# Altium project ArcadeRpiSmartShield 33.PrjPCB
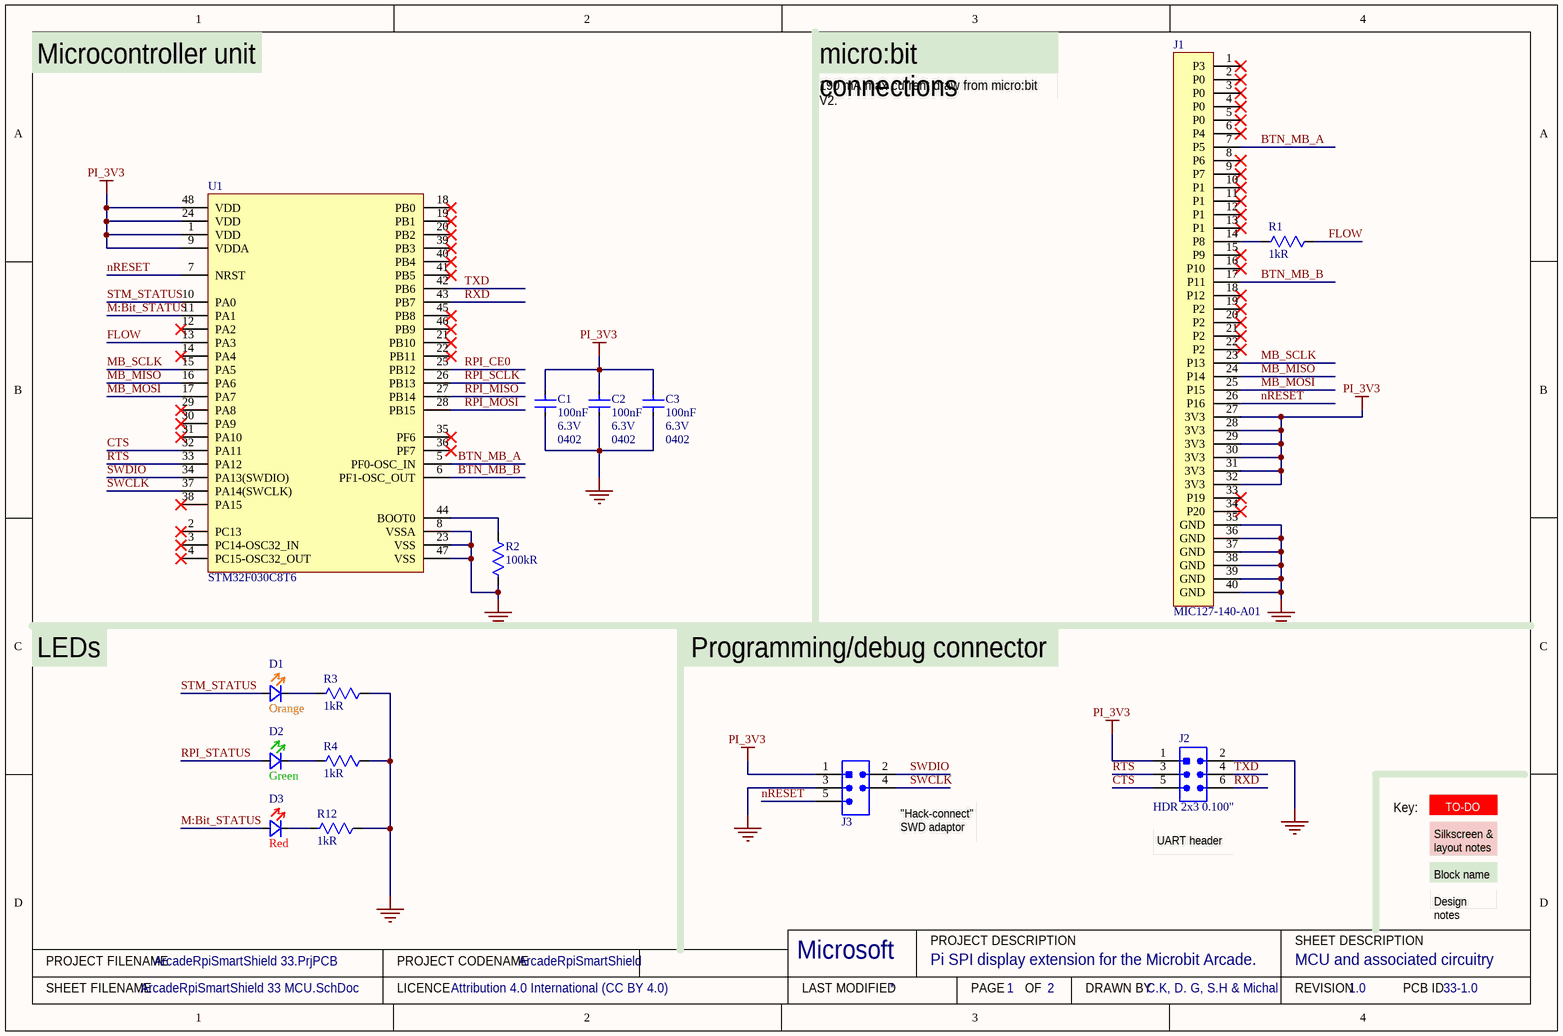
[diagram p0: ArcadeRpiSmartShield 33 MCU.SchDoc]
ProjectCodeName: ArcadeRpiSmartShield; ProjectCodenameDescription: Pi SPI display extension for the Microbit Arcade.; ProjectCodenameID: 33; ProjectDrawnBy: C.K, D. G, S.H & Michal; ProjectLicenceTerms: Attribution 4.0 International (CC BY 4.0); ProjectRevision: 1.0
2 sheets, 24 parts. Net scope: global (net labels, ports and power ports of the same name join across sheets).
Board file: ArcadeRpiSmartShield 33.PcbDoc
Sheets:
  ArcadeRpiSmartShield 33 MCU.SchDoc
  ArcadeRpiSmartShield 33 Pi interface.SchDoc

## Sheet ArcadeRpiSmartShield 33 MCU.SchDoc: MCU and associated circuitry
size A4; DrawnBy: C.K, D. G, S.H & Michal; DocumentNumber: 1; Revision: 1.0; SheetNumber: 1; SheetTotal: 2; VersionControl_RevNumber: 1

### Parts
C1  Capacitance: 100nF  Voltage Rating: 6.3V  Case Code (Imperial): 0402  [C0402_0.55MM - without outline]  (hidden comment: CL05B104KQ5NNNC)
C2  Capacitance: 100nF  Voltage Rating: 6.3V  Case Code (Imperial): 0402  [C0402_0.55MM - without outline]  (hidden comment: CL05B104KQ5NNNC)
C3  Capacitance: 100nF  Voltage Rating: 6.3V  Case Code (Imperial): 0402  [C0402_0.55MM - without outline]  (hidden comment: CL05B104KQ5NNNC)
D1  Colour: Orange  [Rohm SML-D12 Orange - without outline]  (hidden comment: SML-D12D)
D2  Colour: Green  [Rohm SML-D12 Green - without outline]  (hidden comment: SML-D12P)
D3  Colour: Red  [Rohm SML-D12 Red - without outline]  (hidden comment: SML-D12U)
J1  Right Angle 1x40p 1.27 mm pitch edge connector for the micro:bit  [MIC127-140-A01]  (value not drawn)
J2  HDR 2x3 0.100"  [PREC003DFAN-RC]
J3  Hack Connect Mini 1.27 mm pitch 2-row  [HACK_CONNECT_MINI_5_X_1_27]  (value not drawn)  (no BOM)
R1  Resistance: 1kR  [R0402 - Without outline]  (hidden comment: RC0402FR-071KL)
R2  Resistance: 100kR  [R0402 - Without outline]  (hidden comment: RC0402FR-07100KL)
R3  Resistance: 1kR  [R0402 - Without outline]  (hidden comment: RC0402FR-071KL)
R4  Resistance: 1kR  [R0402 - Without outline]  (hidden comment: RC0402FR-071KL)
R12  Resistance: 1kR  [R0402 - Without outline]  (hidden comment: RC0402FR-071KL)
U1  STM32F030C8T6  [48-LQFP (7x7)]

### Nets
GND: C1.1 C2.1 C3.1 J1.35(GND) J1.36(GND) J1.37(GND) J1.38(GND) J1.39(GND) J1.40(GND) J2.2(SWDIO) J3.3(GND) R2.1 R3.1 R4.1 R12.1 U1.8(VSSA) U1.23(VSS) U1.47(VSS)
PI_3V3: C1.2 C2.2 C3.2 J1.27(3V3) J1.28(3V3) J1.29(3V3) J1.30(3V3) J1.31(3V3) J1.32(3V3) J2.1(VCC) J3.1(VCC) U1.1(VDD) U1.9(VDDA) U1.24(VDD) U1.48(VDD)
BTN_MB_A: J1.7(P5) U1.5(PF0-OSC_IN)
BTN_MB_B: J1.17(P11) U1.6(PF1-OSC_OUT)
CTS: J2.5(RESET) U1.32(PA11)
FLOW: R1.1 U1.13(PA3)
M:Bit_STATUS: D3.2(A) U1.11(PA1)
MB_MISO: J1.24(P14) U1.16(PA6)
MB_MOSI: J1.25(P15) U1.17(PA7)
MB_SCLK: J1.23(P13) U1.15(PA5)
nRESET: J1.26(P16) J3.5(RESET) U1.7(NRST)
RPI_CE0: U1.25(PB12)
RPI_MISO: U1.27(PB14)
RPI_MOSI: U1.28(PB15)
RPI_SCLK: U1.26(PB13)
RPI_STATUS: D2.2(A)
RTS: J2.3(GND) U1.33(PA12)
RXD: J2.6 U1.43(PB7)
STM_STATUS: D1.2(A) U1.10(PA0)
SWCLK: J3.4(SWCLK) U1.37(PA14(SWCLK))
SWDIO: J3.2(SWDIO) U1.34(PA13(SWDIO))
TXD: J2.4(SWCLK) U1.42(PB6)
NetD1_1: D1.1(K) R3.2
NetD2_1: D2.1(K) R4.2
NetD3_1: D3.1(K) R12.2
NetJ1_14: J1.14(P8) R1.2
NetR2_2: R2.2 U1.44(BOOT0)

Not connected (* = marked no-connect by the designer): J1 1(P3)* 2(P0)* 3(P0)* 4(P0)* 5(P0)* 6(P4)* 8(P6)* 9(P7)* 10(P1)* 11(P1)* 12(P1)* 13(P1)* 15(P9)* 16(P10)* 18(P12)* 19(P2)* 20(P2)* 21(P2)* 22(P2)* 33(P19)* 34(P20)*; U1 2(PC13)* 3(PC14-OSC32_IN)* 4(PC15-OSC32_OUT)* 12(PA2)* 14(PA4)* 18(PB0)* 19(PB1)* 20(PB2)* 21(PB10)* 22(PB11)* 29(PA8)* 30(PA9)* 31(PA10)* 35(PF6)* 36(PF7)* 38(PA15)* 39(PB3)* 40(PB4)* 41(PB5)* 45(PB8)* 46(PB9)*

### Notes on the sheet
- Microcontroller unit
- 190 mA max current draw from micro:bit V2.
- micro:bit connections
- LEDs
- Programming/debug connector
- (near J3) "Hack-connect" SWD adaptor
- (near J2) UART header
- Key:
- TO-DO
- Silkscreen & layout notes
- Block name
- Design notes
- PROJECT FILENAME
- PROJECT CODENAME
- Microsoft
- PROJECT DESCRIPTION
- SHEET DESCRIPTION
- SHEET FILENAME
- LICENCE
- LAST MODIFIED
- PAGE
- OF
- DRAWN BY
- REVISION
- PCB ID

### Library data of the parts
C1-C3 = CL05B104KQ5NNNC: CAP CER 0.1UF 6.3V X7R 0402; Manufacturer: Samsung; Tolerance: 10%; Supplier 1: Digi-Key; Manufacturer Part Number: CL05B104KQ5NNNC; RoHS: Yes; Category: Capacitors; Stock 1: 259020; Pricing 1: 1=0.10000, 10=0.02500, 50=0.01380, 100=0.01130, 500=0.00804, 1000=0.00632, 2500=0.00575, 5000=0.00529 (USD); Mount: Surface Mount; Case/Package: 0402; Case Code (Metric): 1005; Min Operating Temperature: -55°C; Max Operating Temperature: 125°C; Dielectric: X7R; Packaging: Tape and Reel; Voltage Rating (DC): 6.3V; Length: 1mm; Height: 0.5mm; Thickness: 0.022inch; Depth: 0.5mm; Width: 0.02inch; Radiation Hardening: No; Lead Free: Lead Free; ComponentLink1URL: https://datasheet.ciiva.com/25709/cl05b104kq5nnnc-25709268.pdf; ComponentLink1Description: Online datasheet; Supplier 2: Mouser; Stock 2: 20000; Pricing 2: 1=0.10000, 10=0.02800, 100=0.01200, 500=0.00800, 1000=0.00600, 2500=0.00600 (USD); Supplier Part Number 1: 1276-1511-1-ND; Supplier Part Number 2: 187-CL05B104KQ5NNNC; Created By: D. Gakure; Checked By: ?
D1 = SML-D12D: 1.6 x 0.8 x 0.55mm (0603) LED 605nm Orange; Manufacturer: Rohm Semiconductor; Manufacturer Part Number: SML-D12D8WT86; Millicandela Rating: 100mcd; Voltage - Forward (Vf) (Typ): 2.2V; Current - Test: 20mA; Lens Type: Diffused, White; Lens Style/Size: Rectangle with Flat Top, 1.2mm x 0.8mm; Supplier 1: Digi-Key; RoHS: RoHS Compliant; Category: Optoelectronics; Stock 1: 1719; Pricing 1: 1=0.38, 10=0.279, 25=0.2232, 100=0.1478, 250=0.1046, 500=0.08926, 1000=0.06974 (GBP); Packaging: Cut Tape (CT); Wavelength - Dominant: 605nm; Wavelength - Peak: -; Viewing Angle: -; Package / Case: 0603 (1608 Metric); Size / Dimension: 1.60mm L x 0.80mm W; Height: 0.55mm; Mounting Type: Surface Mount; Luminous Flux @ Current - Test: -; ComponentLink1URL: https://d1d2qsbl8m0m72.cloudfront.net/en/products/databook/datasheet/opto/led/chip_mono/sml-d12x8_d13x8-e.pdf; ComponentLink1Description: Online datasheet; Supplier Part Number 1: 511-1577-1-ND
D2 = SML-D12P: 1.6 x 0.8 x 0.55mm (0603) LED 560nm Green; Manufacturer: Rohm Semiconductor; Manufacturer Part Number: SML-D12P8WT86; Millicandela Rating: 6.3mcd; Voltage - Forward (Vf) (Typ): 2.2V; Current - Test: 20mA; Lens Type: Diffused, White; Lens Style/Size: Rectangle with Flat Top, 1.2mm x 0.8mm; Supplier 1: Digi-Key; RoHS: RoHS Compliant; Category: Optoelectronics; Stock 1: 19305; Pricing 1: 1=0.38, 10=0.279, 25=0.2232, 100=0.1478, 250=0.1046, 500=0.08926, 1000=0.06974 (GBP); Packaging: Cut Tape (CT); Wavelength - Dominant: 560nm; Wavelength - Peak: -; Viewing Angle: -; Package / Case: 0603 (1608 Metric); Size / Dimension: 1.60mm L x 0.80mm W; Height: 0.55mm; Mounting Type: Surface Mount; Luminous Flux @ Current - Test: -; ComponentLink1URL: https://d1d2qsbl8m0m72.cloudfront.net/en/products/databook/datasheet/opto/led/chip_mono/sml-d12x8_d13x8-e.pdf; ComponentLink1Description: Online datasheet; Supplier Part Number 1: 511-1579-1-ND
D3 = SML-D12U: 1.6 x 0.8 x 0.55mm (0603) LED 620nm Red; Manufacturer: Rohm Semiconductor; Manufacturer Part Number: SML-D12U8WT86; Millicandela Rating: 63mcd; Voltage - Forward (Vf) (Typ): 2.2V; Current - Test: 20mA; Lens Type: Diffused, White; Lens Style/Size: Rectangle with Flat Top, 1.2mm x 0.8mm; Supplier 1: Digi-Key; RoHS: RoHS Compliant; Category: Optoelectronics; Stock 1: 5722; Pricing 1: 1=0.38, 10=0.279, 25=0.2232, 100=0.1478, 250=0.1046, 500=0.08926, 1000=0.06974 (GBP); Packaging: Cut Tape (CT); Wavelength - Dominant: 620nm; Wavelength - Peak: -; Viewing Angle: -; Package / Case: 0603 (1608 Metric); Size / Dimension: 1.60mm L x 0.80mm W; Height: 0.55mm; Mounting Type: Surface Mount; Luminous Flux @ Current - Test: -; ComponentLink1URL: https://d1d2qsbl8m0m72.cloudfront.net/en/products/databook/datasheet/opto/led/chip_mono/sml-d12x8_d13x8-e.pdf; ComponentLink1Description: Online datasheet; Supplier 2: Farnell; Supplier Part Number 1: 511-1580-1-ND; Supplier Part Number 2: 1685094
J1 = MIC127-140-A01: "Right Angle" 1x40p 1.27mm Dongguan Yuliang BBC micro:bit edge connector; Manufacturer: Dongguan Yuliang; ComponentLink1Description: Yuliang drawing; ComponentLink1URL: http://www.dgyuliang.net/d/file/Produtcs/Customized%20Connector/MICRO%20BIT%20Connector/0d43030af84ade6fc3f00e242079c055.pdf; Manufacturer Part Number: MIC127-140-A01
J2 = PREC003DFAN-RC: CONN HEADER VERT 6POS 2.54MM; Manufacturer: Sullins; Number of Positions: 6; Connector Type: Male Pin; Pitch: 0.1inch; Supplier 1: Digi-Key; Manufacturer Part Number: PREC003DFAN-RC; RoHS: Yes; Category: Connectors; Stock 1: 1243; Pricing 1: 1=0.16000, 10=0.15100, 25=0.12920, 50=0.11280, 100=0.10480, 250=0.09272, 500=0.08870 (USD); Mount: Through Hole; Color: Black; Contact Plating: Tin; Package Quantity: 1; Number of Rows: 2; Packaging: Bulk; Termination: Solder; Contact Type: Male Pin; Row Spacing: 0.1inch; Contact Mating Length: 0.318inch; RoHS Compliant: Yes; ComponentLink1URL: https://datasheet.ciiva.com/741/xrxczzzdxxn-rc-11636-b-741002.pdf; ComponentLink1Description: Online datasheet; Created By: D. Gakure; Checked By: ?; Supplier Part Number 1: S2212EC-03-ND
J3 = HACK_CONNECT_MINI
R1 R3 R4 R12 = RC0402FR-071KL: RES SMD 1K OHM 1% 1/16W 0402; Manufacturer: Yageo; Temperature Coefficient: 100ppm/°C; Voltage Rating (DC): 50V; Power Rating: 62.5mW; Supplier 1: Digi-Key; Manufacturer Part Number: RC0402FR-071KL; RoHS: Yes; Category: Resistors; Stock 1: 37591306; Pricing 1: 1=0.10000, 10=0.01400, 100=0.00580, 1000=0.00262, 2500=0.00228, 5000=0.00188 (USD); Case/Package: 0402; Number of Pins: 2; Case Code (Imperial): 0402; Case Code (Metric): 1005; Min Operating Temperature: -55°C; Max Operating Temperature: 155°C; Resistor Type: Thick Film; Tolerance: 1%; Packaging: Tape and Reel; Voltage Rating: 50V; Termination: SMD/SMT; Length: 1mm; Height: 0.32mm; Width: 0.5mm; Depth: 0.5mm; REACH SVHC: Unknown; Lead Free: Lead Free; Military Standard: Not; ComponentLink2URL: https://datasheet.ciiva.com/12666/pyu-rc0402-51-rohs-l-6-r-12666741.pdf; ComponentLink2Description: Online datasheet; Supplier 2: Mouser; Stock 2: 11912978; Pricing 2: 1=0.10000, 10=0.01200, 100=0.00400, 1000=0.00400, 2500=0.00400, 10000=0.00300 (USD); Supplier 3: Farnell; Stock 3: 29900; Pricing 3: 1=0.08130, 25=0.01210, 100=0.01120, 250=0.01030, 500=0.00900 (GBP); Supplier Part Number 3: 2132441; Supplier Part Number 2: 603-RC0402FR-071KL; Supplier Part Number 1: 311-1.00KLRDKR-ND; Created: D.G; Checked: ?
R2 = RC0402FR-07100KL: RES SMD 100K OHM 1% 1/16W 0402; Manufacturer: Yageo; Temperature Coefficient: 100ppm/°C; Power Rating: 63mW; Voltage Rating: 50V; Supplier 1: Digi-Key; Manufacturer Part Number: RC0402FR-07100KL; RoHS: Yes; Category: Resistors; Stock 1: 5819191; Pricing 1: 1=0.10000, 10=0.01400, 100=0.00580, 1000=0.00262, 2500=0.00228, 5000=0.00188 (USD); Case Code (Metric): 1005; Case Code (Imperial): 0402; Min Operating Temperature: -55°C; Max Operating Temperature: 155°C; Resistor Type: Thick Film; Packaging: Tape and Reel; Package Quantity: 1; Number of Terminations: 2; Termination: SMD/SMT; Max Power Dissipation: 63mW; Working Voltage: 50V; Features: Moisture Resistant; Length: 0.039inch; Height: 0.016inch; Width: 0.02inch; Depth: 0.5mm; REACH SVHC: No SVHC; Lead Free: Lead Free; Military Standard: Not; ComponentLink2URL: https://datasheet.ciiva.com/2453/pyu-r-int-thick-7-2453361.pdf; ComponentLink2Description: Online datasheet; Supplier 2: Mouser; Stock 2: 4458847; Pricing 2: 1=0.10000, 10=0.01200, 100=0.00400, 1000=0.00400, 2500=0.00400, 10000=0.00300 (USD); Supplier 3: Farnell; Stock 3: 19392; Pricing 3: 1=0.10200, 25=0.01220, 100=0.01200, 250=0.01020, 500=0.00890 (GBP); Created By: DG; Checked By: ?; Supplier Part Number 3: 2131798; Supplier Part Number 1: 311-100KLRCT-ND; Supplier Part Number 2: 603-RC0402FR-07100KL; Tolerance: 1%; Case/Package: 0402
U1 = STM32F030C8T6: MCU 32-bit STM32F ARM Cortex M0 RISC 64KB Flash 2.5V/3.3V 48-Pin LQFP Tray; Manufacturer: STMicroelectronics; Max Supply Voltage: 3.6V; Number of I/Os: 39; Interface: I2C,SPI,UART,USART; Frequency: 48MHz; RAM Size: 8KB; Max Power Dissipation: 364mW; Number of Timers/Counters: 7; Min Supply Voltage: 2.4V; Data Bus Width: 32b; Oscillator Type: Internal; Number of ADC Channels: 12; Number of SPI Channels: 2; Number of PWM Channels: 6; Watchdog Timer: Yes; Peripherals: POR,PWM,WDT,DMA; Supplier 1: Digi-Key; RoHS: Yes; Category: Microcontrollers; Pricing 1: 1=2.31000, 10=2.07200, 25=1.95520, 80=1.66575, 250=1.56408, 500=1.36856, 1000=1.30340 (USD); Case/Package: LQFP; Number of Pins: 48; Contact Plating: Tin,Matte; Min Operating Temperature: -40°C; Max Operating Temperature: 85°C; Package Quantity: 250; Packaging: Tray; Number of Programmable I/O: 39; Max Frequency: 48MHz; Number of I2C Channels: 2; Memory Type: FLASH; Memory Size: 64KB; Core Architecture: ARM; Length: 7.2mm; Width: 7.2mm; Height: 1.45mm; Radiation Hardening: No; REACH SVHC: No SVHC; Lead Free: Lead Free; RoHS Compliant: Yes; ComponentLink1URL: https://datasheet.ciiva.com/28647/1792126-28647793.pdf; ComponentLink1Description: Online datasheet; Supplier 2: Avnet; Stock 2: 325; Pricing 2: 1=2.19000, 10=1.88000, 100=1.63000, 500=1.38000, 1000=1.16000, 2500=1.13000 (USD); Supplier Part Number 2: 39X0182; Supplier Part Number 1: 497-14043-ND; Created By: D. Gakure; Checked By: ?; Manufacturer Part Number: STM32F030C8T6

## Sheet ArcadeRpiSmartShield 33 Pi interface.SchDoc: R Pi interface circuitry
size A4; DrawnBy: C.K, D. G, S.H & Michal; DocumentNumber: 2; Revision: 1.0; SheetNumber: 2; SheetTotal: 2; VersionControl_RevNumber: 1
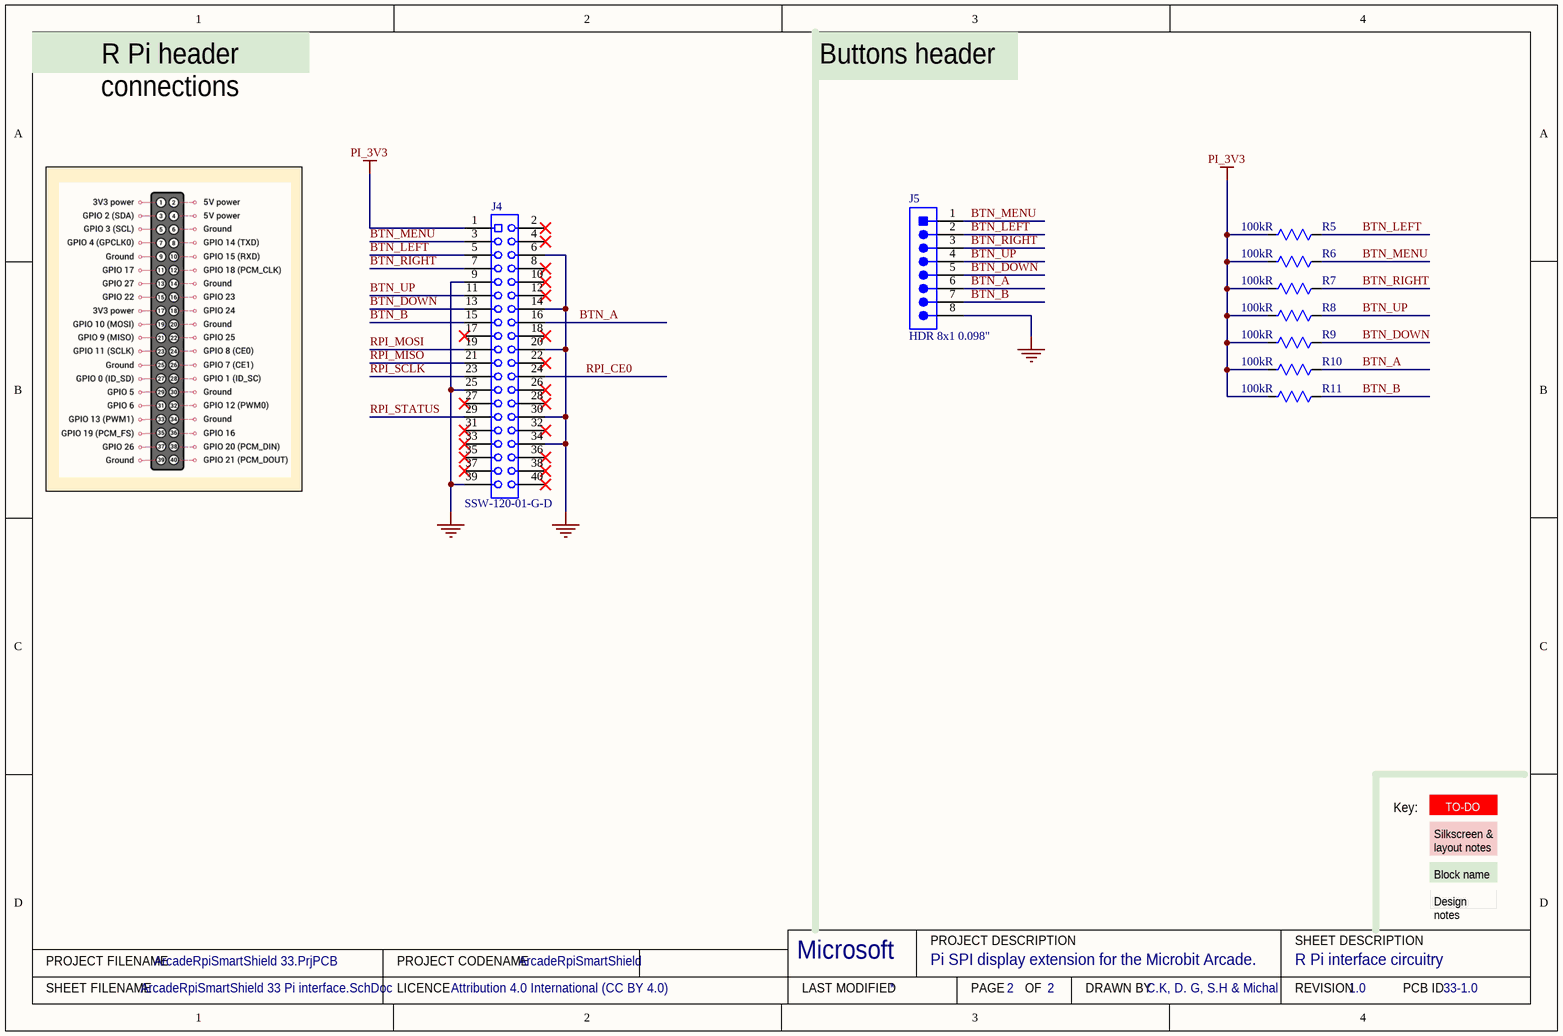
[diagram p1: ArcadeRpiSmartShield 33 Pi interface.SchDoc]

### Parts
J4  SSW-120-01-G-D  [SAMTEC-SSW-120-01-G-D]
J5  HDR 8x1 0.098"  [B8B-XH-A(LF)(SN)]
R5  Resistance: 100kR  [R0402 - Without outline]  (hidden comment: RC0402FR-07100KL)
R6  Resistance: 100kR  [R0402 - Without outline]  (hidden comment: RC0402FR-07100KL)
R7  Resistance: 100kR  [R0402 - Without outline]  (hidden comment: RC0402FR-07100KL)
R8  Resistance: 100kR  [R0402 - Without outline]  (hidden comment: RC0402FR-07100KL)
R9  Resistance: 100kR  [R0402 - Without outline]  (hidden comment: RC0402FR-07100KL)
R10  Resistance: 100kR  [R0402 - Without outline]  (hidden comment: RC0402FR-07100KL)
R11  Resistance: 100kR  [R0402 - Without outline]  (hidden comment: RC0402FR-07100KL)

### Nets
GND: J4.6 J4.9 J4.14 J4.20 J4.25 J4.30 J4.34 J4.39 J5.8
PI_3V3: J4.1 R5.1 R6.1 R7.1 R8.1 R9.1 R10.1 R11.1
BTN_A: J4.16 J5.6 R10.2
BTN_B: J4.15 J5.7 R11.2
BTN_DOWN: J4.13 J5.5 R9.2
BTN_LEFT: J4.5 J5.2 R5.2
BTN_MENU: J4.3 J5.1 R6.2
BTN_RIGHT: J4.7 J5.3 R7.2
BTN_UP: J4.11 J5.4 R8.2
RPI_CE0: J4.24
RPI_MISO: J4.21
RPI_MOSI: J4.19
RPI_SCLK: J4.23
RPI_STATUS: J4.29

Not connected (* = marked no-connect by the designer): J4 2* 4* 8* 10* 12* 17* 18* 22* 26* 27* 28* 31* 32* 33* 35* 36* 37* 38* 40*

### Notes on the sheet
- R Pi header connections
- Buttons header
- Key:
- TO-DO
- Silkscreen & layout notes
- Block name
- Design notes
- PROJECT FILENAME
- PROJECT CODENAME
- Microsoft
- PROJECT DESCRIPTION
- SHEET DESCRIPTION
- SHEET FILENAME
- LICENCE
- LAST MODIFIED
- PAGE
- OF
- DRAWN BY
- REVISION
- PCB ID

### Library data of the parts
J4 = SSW-120-01-G-D: 20 position 2 row (40 way) 0.1" TH socket; Manufacturer: Samtec; Number of Contacts: 40; Gender: Receptacle; Connector Type: Receptacle,Socket; Contact Resistance: 10mR; Max Current Rating: 6.9A; Max Voltage Rating (AC): 550V; Mating Cycles: 100; Pitch: 2.54mm; Row Spacing: 0.1inch; ComponentLink1Description: samtec catalogue page online; ComponentLink1URL: http://suddendocs.samtec.com/catalog_english/ssw_th.pdf; ComponentLink2Description: samtec drawing online; ComponentLink2URL: http://suddendocs.samtec.com/prints/ssw-1xx-xx-xxx-x-xx-xxx-xx-mkt.pdf; Supplier 1: Digi-Key; Manufacturer Part Number: SSW-120-01-G-D; Stock 1: 0; Pricing 1: 1=5.36000, 10=5.14900, 25=4.72040, 50=4.50580, 100=4.29120, 250=3.75480, 500=3.64752 (USD); RoHS: Yes; Mount: Through Hole; Contact Plating: Gold; Color: Black; Contact Material: Bronze; Housing Color: Black; Housing Material: Polymer; Min Operating Temperature: -55°C; Max Operating Temperature: 125°C; Number of Rows: 2; Termination: Solder; Packaging: Bulk; Number of Positions: 40; Orientation: Straight; Current Rating: 6.9A; Voltage Rating: 550V; Length: 51.31mm; Depth: 4.95mm; Lead Pitch: 2.54mm; Radiation Hardening: No; Lead Free: Lead Free; REACH SVHC: No SVHC; Supplier 2: Farnell; Supplier 3: Mouser; Supplier 4: RSComponents; Supplier Part Number 1: SAM1208-20-ND; Supplier Part Number 2: 1668397; Supplier Part Number 3: 200-SSW12001GD; Supplier Part Number 4: 7655802
J5 = B8B-XH-A(LF)(SN): CONN HEADER VERT 8POS 2.5MM; Manufacturer: JST; Number of Positions: 8; Current Rating: 3A; Connector Type: Male Pin; Max Voltage Rating (AC): 250V; Insulation Resistance: 1GR; Contact Resistance: 20mR; Wire/Cable Gauge: 22AWG; Supplier 1: Digi-Key; Manufacturer Part Number: B8B-XH-A(LF)(SN); RoHS: Yes; Category: FFC / FPC; Stock 1: 6017; Pricing 1: 1=0.360000, 10=0.341000, 100=0.238700, 500=0.204580, 1000=0.170480, 5000=0.146130, 10000=0.136390 (USD); Mount: Through Hole; Color: Natural; Contact Material: Brass; Contact Plating: Tin,Copper,Lead; Housing Color: White; Housing Material: Polyamide; Min Operating Temperature: -25°C; Max Operating Temperature: 85°C; Packaging: Bulk; Termination: Press-Fit; Number of Rows: 1; Orientation: Straight; Fastening Type: Detent; Number of Contacts: 8; Max Current Rating: 3A; Voltage Rating (AC): 250V; Voltage Rating: 250V; Length: 22.4mm; Pitch: 2.5mm; Depth: 5.75mm; Lead Pitch: 2.5mm; REACH SVHC: No SVHC; Lead Free: Lead Free; ComponentLink1URL: https://datasheet.ciiva.com/26894/getdatasheetpartid-440408-26894817.pdf; ComponentLink1Description: Online datasheet; Supplier 2: Farnell; Stock 2: 11541; Pricing 2: 10=0.27000, 100=0.18800, 500=0.16200, 1000=0.13500, 2500=0.12500, 5000=0.11500 (GBP); Supplier Part Number 1: 455-2251-ND; Supplier Part Number 2: 1516284; Created By: D. Gakure; Checked By: ?
R5-R11 = RC0402FR-07100KL: as R2 on sheet ArcadeRpiSmartShield 33 MCU; Supplier 1: Digi-Key; Manufacturer Part Number: RC0402FR-07100KL; RoHS: Yes; Category: Resistors; Stock 1: 5819191; Pricing 1: 1=0.10000, 10=0.01400, 100=0.00580, 1000=0.00262, 2500=0.00228, 5000=0.00188 (USD); Case Code (Metric): 1005; Case Code (Imperial): 0402; Min Operating Temperature: -55°C; Max Operating Temperature: 155°C; Resistor Type: Thick Film; Packaging: Tape and Reel; Package Quantity: 1; Number of Terminations: 2; Termination: SMD/SMT; Max Power Dissipation: 63mW; Working Voltage: 50V; Features: Moisture Resistant; Length: 0.039inch; Height: 0.016inch; Width: 0.02inch; Depth: 0.5mm; REACH SVHC: No SVHC; Lead Free: Lead Free; Military Standard: Not; ComponentLink2URL: https://datasheet.ciiva.com/2453/pyu-r-int-thick-7-2453361.pdf; ComponentLink2Description: Online datasheet; Supplier 2: Mouser; Stock 2: 4458847; Pricing 2: 1=0.10000, 10=0.01200, 100=0.00400, 1000=0.00400, 2500=0.00400, 10000=0.00300 (USD); Supplier 3: Farnell; Stock 3: 19392; Pricing 3: 1=0.10200, 25=0.01220, 100=0.01200, 250=0.01020, 500=0.00890 (GBP); Created By: DG; Checked By: ?; Supplier Part Number 3: 2131798; Supplier Part Number 1: 311-100KLRCT-ND; Supplier Part Number 2: 603-RC0402FR-07100KL; Tolerance: 1%; Case/Package: 0402

## Nets that join several sheets
GND: ArcadeRpiSmartShield 33 MCU (18 pins), ArcadeRpiSmartShield 33 Pi interface (9 pins)
PI_3V3: ArcadeRpiSmartShield 33 MCU (15 pins), ArcadeRpiSmartShield 33 Pi interface (8 pins)
RPI_CE0: ArcadeRpiSmartShield 33 MCU (U1.25), ArcadeRpiSmartShield 33 Pi interface (J4.24)
RPI_MISO: ArcadeRpiSmartShield 33 MCU (U1.27), ArcadeRpiSmartShield 33 Pi interface (J4.21)
RPI_MOSI: ArcadeRpiSmartShield 33 MCU (U1.28), ArcadeRpiSmartShield 33 Pi interface (J4.19)
RPI_SCLK: ArcadeRpiSmartShield 33 MCU (U1.26), ArcadeRpiSmartShield 33 Pi interface (J4.23)
RPI_STATUS: ArcadeRpiSmartShield 33 MCU (D2.2), ArcadeRpiSmartShield 33 Pi interface (J4.29)